# EAGLE design module (EAGLE 6.4)
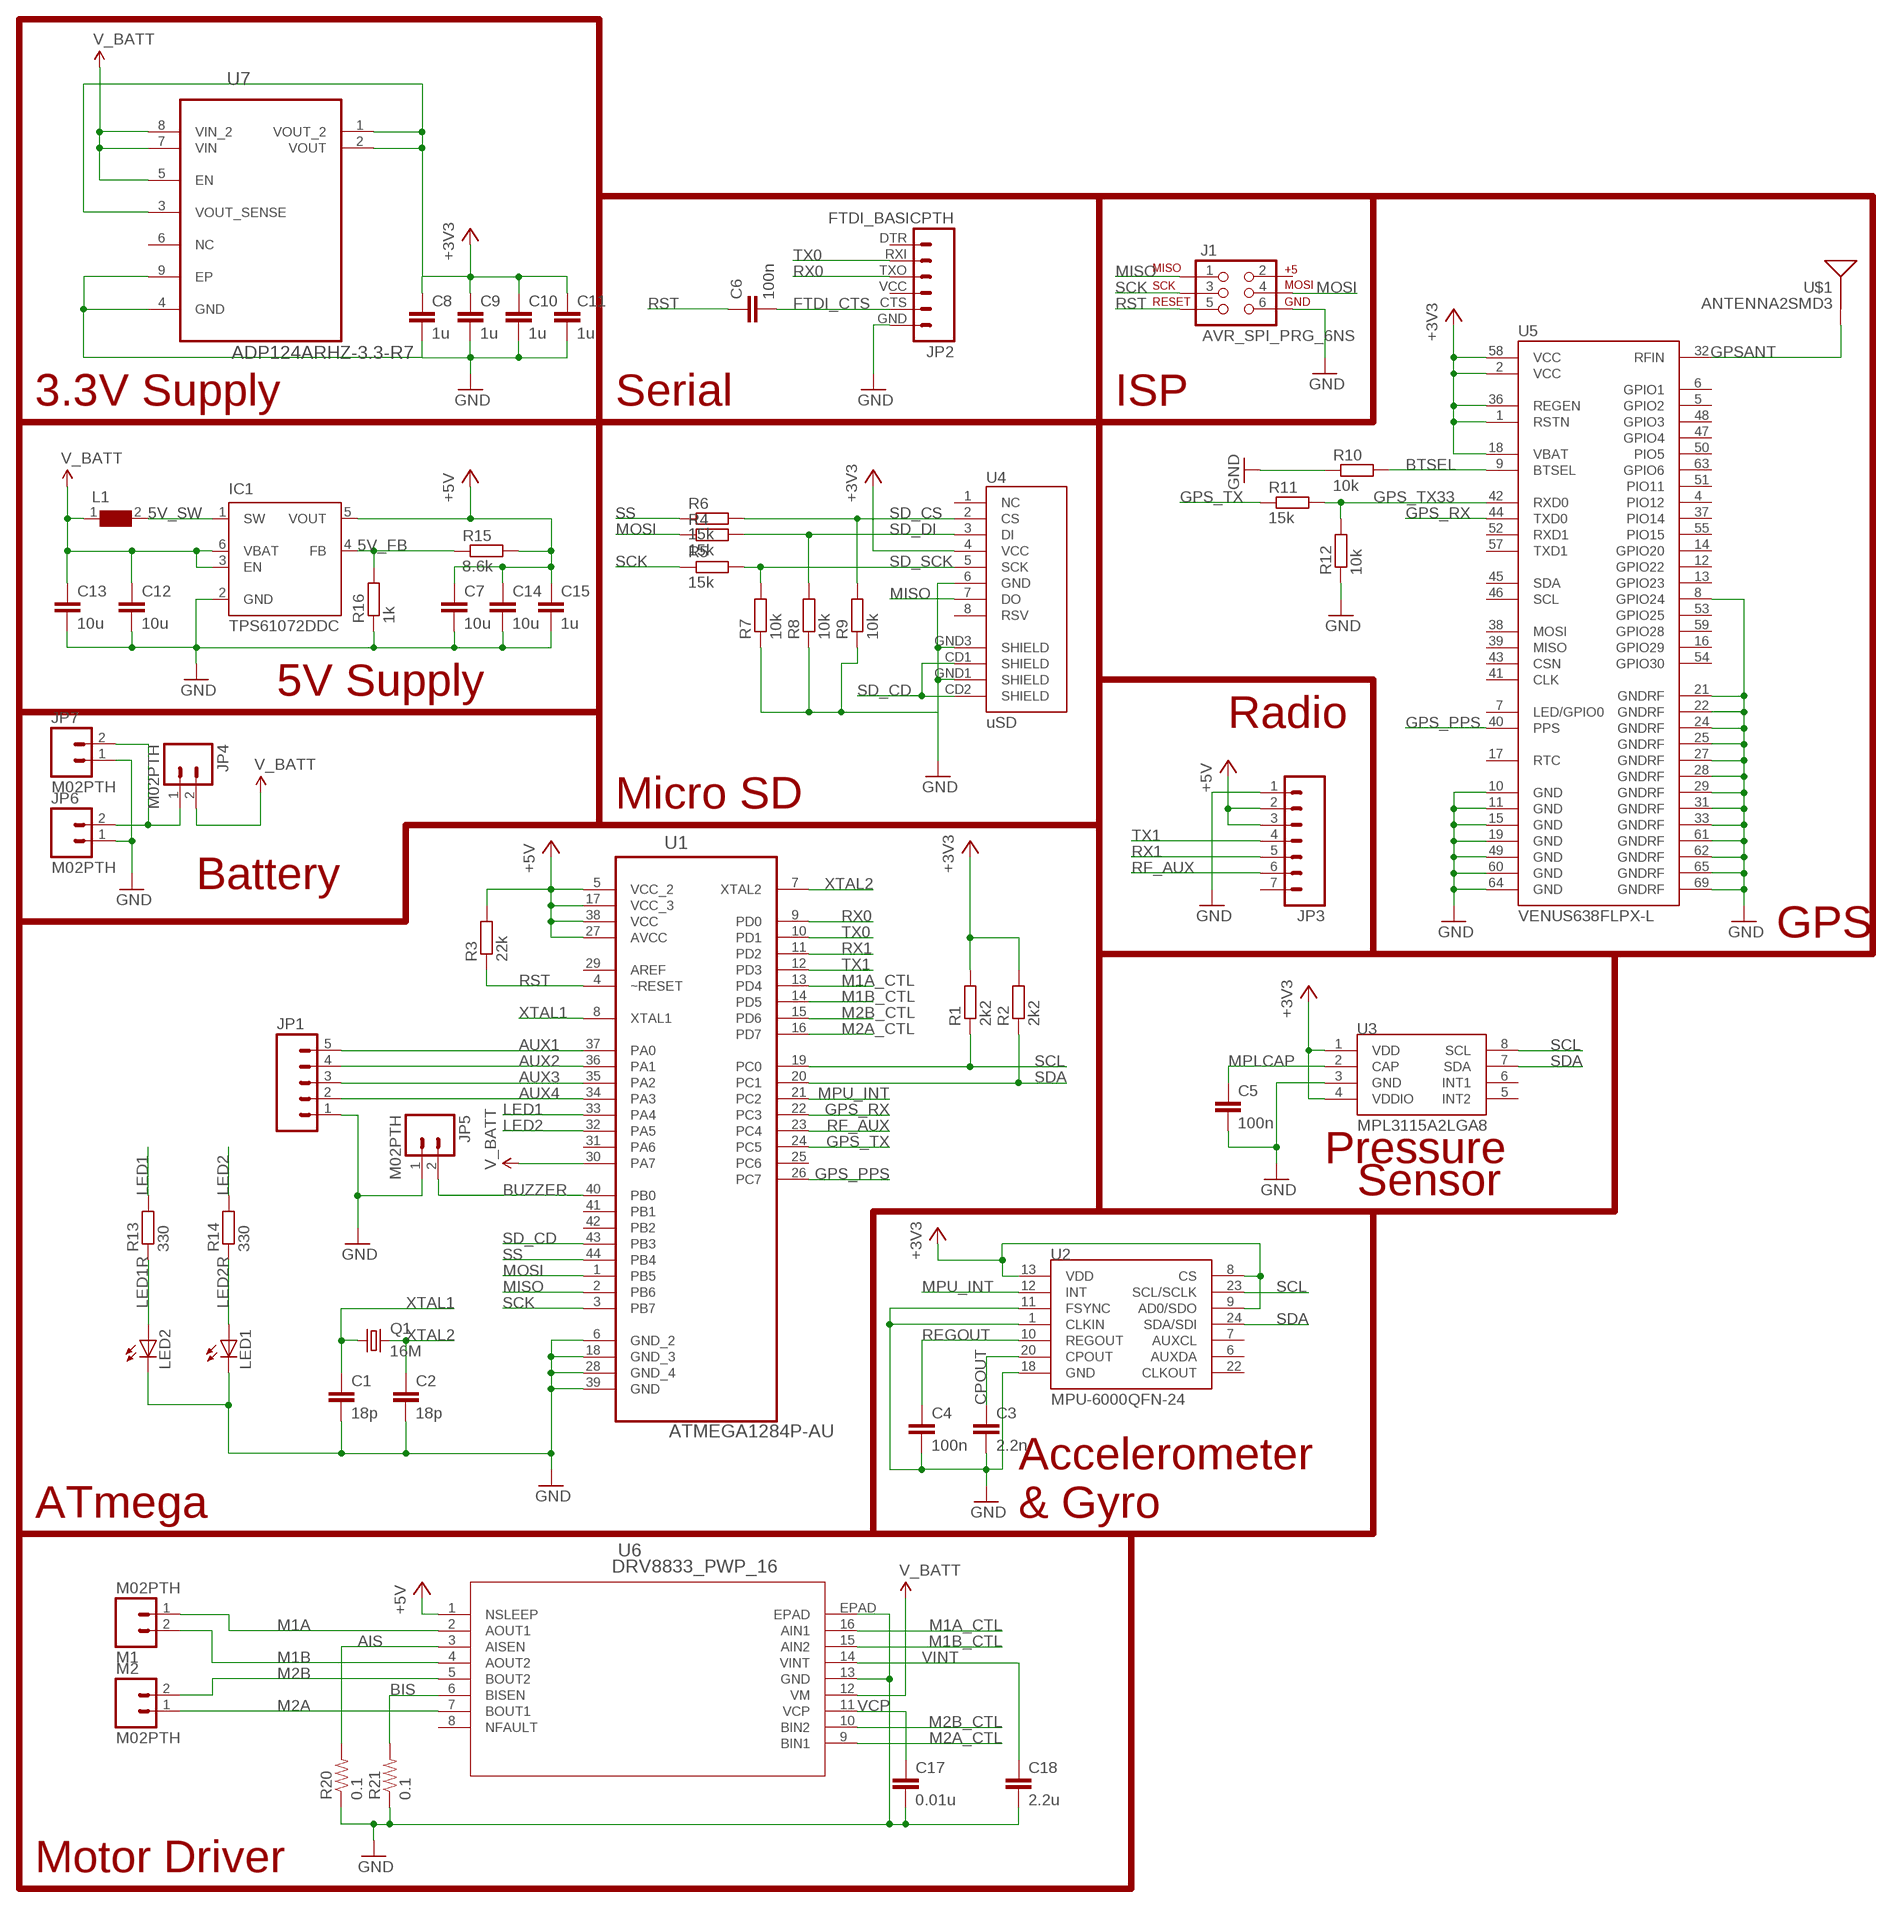
[diagram p0: schematic, sheet 1]

## Parts
C1  18p  C-EUC0805  [C0805]
C2  18p  C-EUC0805  [C0805]
C3  2.2n  C-EUC0805  [C0805]
C4  100n  C-EUC0805  [C0805]
C5  100n  C-EUC0805  [C0805]
C6  100n  C-EUC0805  [C0805]
C7  10u  C-EUC0805  [C0805]
C8  1u  C-EUC0603  [C0603]
C9  1u  C-EUC0603  [C0603]
C10  1u  C-EUC0603  [C0603]
C11  1u  C-EUC0603  [C0603]
C12  10u  C-EUC0805  [C0805]
C13  10u  C-EUC0805  [C0805]
C14  10u  C-EUC0805  [C0805]
C15  1u  C-EUC0805  [C0805]
C17  0.01u  CAP0805  [0805]
C18  2.2u  CAP0805  [0805]
IC1  TPS61072DDC  [TSOT23-6_DDC]
J1  AVR_SPI_PRG_6NS  [2X3-NS]
JP1  M05PTH  [1X05]
JP2  FTDI_BASICPTH  [FTDI_BASIC]
JP3  M07  [1X07]
JP4  M02PTH  [1X02]
JP5  M02PTH  [1X02]
JP6  M02PTH  [1X02]
JP7  M02PTH  [1X02]
L1  WE-TPC-744031004_3816  [WE-TPC_3816]
LED1  LEDCHIPLED_0805  [CHIPLED_0805]
LED2  LEDCHIPLED_0805  [CHIPLED_0805]
M1  M02PTH  [1X02]
M2  M02PTH  [1X02]
Q1  16M  CRYSTALHC49UP  [HC49UP]
R1  2k2  R-EU_R0805  [R0805]
R2  2k2  R-EU_R0805  [R0805]
R3  22k  R-EU_R0805  [R0805]
R4  15k  R-EU_R0805  [R0805]
R5  15k  R-EU_R0805  [R0805]
R6  15k  R-EU_R0805  [R0805]
R7  10k  R-EU_R0805  [R0805]
R8  10k  R-EU_R0805  [R0805]
R9  10k  R-EU_R0805  [R0805]
R10  10k  R-EU_R0805  [R0805]
R11  15k  R-EU_R0805  [R0805]
R12  10k  R-EU_R0805  [R0805]
R13  330  R-EU_R0805  [R0805]
R14  330  R-EU_R0805  [R0805]
R15  8.6k  R-EU_R0805  [R0805]
R16  1k  R-EU_R0805  [R0805]
R20  0.1  RESISTOR1206  [1206]
R21  0.1  RESISTOR1206  [1206]
U1  ATMEGA1284P-AU  [QFP80P1200X1200X120-44N]
U2  MPU-6000QFN-24  [QFN-24-TESTING]
U3  MPL3115A2LGA8  [LGA8]
U4  uSD  USD-SOCKETNEW  [MICRO-SD-SOCKET-PP]
U5  VENUS638FLPX-L  [VENUS638FLPX]
U6  DRV8833_PWP_16  [PWP16_2P31X2P46]
U7  ADP124ARHZ-3.3-R7  [SOP65P490X110-9N]
U$1  ANTENNA2SMD3  [ANTENNA-CHIP4]

## Nets
5V_FB: IC1.4(FB) R15.1 R16.2
5V_SW: IC1.1(SW) L1.2
+3V3: C8.1 C9.1 C10.1 C11.1 R1.2 R2.2 U2.8(CS) U2.9(AD0/SDO) U2.13(VDD) U3.1(VDD) U3.4(VDDIO) U4.4(VCC) U5.1(RSTN) U5.2(VCC) U5.18(VBAT) U5.36(REGEN) U5.58(VCC) U7.1(VOUT_2) U7.2(VOUT) U7.3(VOUT_SENSE)
+5V: C7.1 C14.1 C15.1 IC1.5(VOUT) JP3.2 JP3.3 R3.2 R15.2 U1.5(VCC_2) U1.17(VCC_3) U1.27(AVCC) U1.38(VCC) U6.1(NSLEEP)
AIS: R20.2 U6.3(AISEN)
AUX1: JP1.5 U1.37(PA0)
AUX2: JP1.4 U1.36(PA1)
AUX3: JP1.3 U1.35(PA2)
AUX4: JP1.2 U1.34(PA3)
BIS: R21.2 U6.6(BISEN)
BTSEL: R10.2 U5.9(BTSEL)
BUZZER: JP5.2 U1.40(PB0)
CPOUT: C3.1 U2.20(CPOUT)
FTDI_CTS: C6.2 JP2.CTS
GND: C1.2 C2.2 C3.2 C4.2 C5.2 C7.2 C8.2 C9.2 C10.2 C11.2 C12.2 C13.2 C14.2 C15.2 C17.2 C18.2 IC1.2(GND) J1.6 JP1.1 JP2.GND JP3.1 JP5.1 JP6.1 JP7.1 LED1.C LED2.C R7.1 R8.1 R9.1 R10.1 R12.1 R16.1 R20.1 R21.1 U1.6(GND_2) U1.18(GND_3) U1.28(GND_4) U1.39(GND) U2.1(CLKIN) U2.11(FSYNC) U2.18(GND) U3.3(GND) U4.6(GND) U4.GND1(SHIELD) U4.GND3(SHIELD) U5.8(GPIO24) U5.10(GND) U5.11(GND) U5.15(GND) U5.19(GND) U5.21(GNDRF) U5.22(GNDRF) U5.24(GNDRF) U5.25(GNDRF) U5.27(GNDRF) U5.28(GNDRF) U5.29(GNDRF) U5.31(GNDRF) U5.33(GNDRF) U5.49(GND) U5.60(GND) U5.61(GNDRF) U5.62(GNDRF) U5.64(GND) U5.65(GNDRF) U5.69(GNDRF) U6.13(GND) U6.EPAD U7.4(GND) U7.9(EP)
GPS_PPS: U1.26(PC7) U5.40(PPS)
GPS_RX: U1.22(PC3) U5.44(TXD0)
GPS_TX: R11.1 U1.24(PC5)
GPS_TX33: R11.2 R12.2 U5.42(RXD0)
GPSANT: U5.32(RFIN) U$1.SIG(SIGNAL)
LED1: R13.2 U1.33(PA4)
LED1R: LED2.A R13.1
LED2: R14.2 U1.32(PA5)
LED2R: LED1.A R14.1
M1A: M1.1 U6.2(AOUT1)
M1A_CTL: U1.13(PD4) U6.16(AIN1)
M1B: M1.2 U6.4(AOUT2)
M1B_CTL: U1.14(PD5) U6.15(AIN2)
M2A: M2.1 U6.7(BOUT1)
M2A_CTL: U1.16(PD7) U6.9(BIN1)
M2B: M2.2 U6.5(BOUT2)
M2B_CTL: U1.15(PD6) U6.10(BIN2)
MISO: J1.1 U1.2(PB6) U4.7(DO)
MOSI: J1.4 R4.1 U1.1(PB5)
MPLCAP: C5.1 U3.2(CAP)
MPU_INT: U1.21(PC2) U2.12(INT)
N$3: JP4.1 JP6.2 JP7.2
REGOUT: C4.1 U2.10(REGOUT)
RF_AUX: JP3.6 U1.23(PC4)
RST: C6.1 J1.5 R3.1 U1.4(~RESET)
RX0: JP2.TXO U1.9(PD0)
RX1: JP3.5 U1.11(PD2)
SCK: J1.3 R5.1 U1.3(PB7)
SCL: R1.1 U1.19(PC0) U2.23(SCL/SCLK) U3.8(SCL)
SD_CD: U1.43(PB3) U4.CD1(SHIELD) U4.CD2(SHIELD)
SD_CS: R6.2 R9.2 U4.2(CS)
SD_DI: R4.2 R8.2 U4.3(DI)
SD_SCK: R5.2 R7.2 U4.5(SCK)
SDA: R2.1 U1.20(PC1) U2.24(SDA/SDI) U3.7(SDA)
SS: R6.1 U1.44(PB4)
TX0: JP2.RXI U1.10(PD1)
TX1: JP3.4 U1.12(PD3)
V_BATT: C12.1 C13.1 IC1.3(EN) IC1.6(VBAT) JP4.2 L1.1 U1.30(PA7) U6.12(VM) U7.5(EN) U7.7(VIN) U7.8(VIN_2)
VCP: C17.1 U6.11(VCP)
VINT: C18.1 U6.14(VINT)
XTAL1: C1.1 Q1.1 U1.8(XTAL1)
XTAL2: C2.1 Q1.2 U1.7(XTAL2)
Unconnected: J1.2 JP2.DTR JP2.VCC JP3.7 U1.25(PC6) U1.29(AREF) U1.31(PA6) U1.41(PB1) U1.42(PB2) U2.6(AUXDA) U2.7(AUXCL) U2.22(CLKOUT) U3.5(INT2) U3.6(INT1) U4.1(NC) U4.8(RSV) U5.4(PIO12) U5.5(GPIO2) U5.6(GPIO1) U5.7(LED/GPIO0) U5.12(GPIO22) U5.13(GPIO23) U5.14(GPIO20) U5.16(GPIO29) U5.17(RTC) U5.37(PIO14) U5.38(MOSI) U5.39(MISO) U5.41(CLK) U5.43(CSN) U5.45(SDA) U5.46(SCL) U5.47(GPIO4) U5.48(GPIO3) U5.50(PIO5) U5.51(PIO11) U5.52(RXD1) U5.53(GPIO25) U5.54(GPIO30) U5.55(PIO15) U5.57(TXD1) U5.59(GPIO28) U5.63(GPIO6) U6.8(NFAULT) U7.6(NC)

## Notes on the sheet
- 3.3V Supply | Serial | ISP
- 5V Supply
- Radio
- Micro SD
- Battery
- GPS
- Pressure
- Sensor
- ATmega
- Accelerometer
  & Gyro
- Motor Driver

## Library data of the parts
C1-C15 = rcl:C-EU: CAPACITOR, European symbol
C17 C18 = SparkFun-Passives:CAP: Capacitor Standard 0603 ceramic capacitor, and 0.1" leaded capacitor.
IC1 = texas:TPS6107*: 90% EFFICIENT SYNCHRONOUS BOOST CONVERTER WITH 600-mA SWITCH Source: http://focus.ti.com/lit/ds/symlink/tps61070.pdf; MPN: TPS61072DDCR; OC_FARNELL: unknown; OC_NEWARK: 30M1829
J1 = SparkFun-Connectors:AVR_SPI_PRG_6: AVR ISP 6 Pin This is the reduced ISP connector for AVR programming. Common on Arduino. This footprint will take up less PCB space and can be used with a 10-pin to 6-pin adapter such as SKU: BOB-08508
JP1 = SparkFun-Connectors:M05: Header 5 Standard 5-pin 0.1" header. Use with straight break away headers (SKU : PRT-00116), right angle break away headers (PRT-00553), swiss pins (PRT-00743), machine pins (PRT-00117), and female headers (PRT-00115). Molex polarized connector foot print use with SKU : PRT-08230 with associated crimp pins and housings.
JP2 = SparkFun-Connectors:FTDI_BASIC: FTDI Basic header with labels
JP3 = SparkFun-Connectors:M07: Header 7 Standard 7-pin 0.1" header. Use with straight break away headers (SKU : PRT-00116), right angle break away headers (PRT-00553), swiss pins (PRT-00743), machine pins (PRT-00117), and female headers (PRT-00115). NOTES ON THE VARIANTS LOCK and LOCK_LONGPADS... This footprint was designed to help hold the alignment of a through-hole component (i.e. 7-pin header) while soldering it into place. You may notice that each hole has been shifted either up or down by 0.005 of an inch from it's more standard position (which is usually a perfectly straight line). This slight alteration caused the pins (the squares in the middle) to touch the edges of the holes. Because they are alternating, it causes a "brace" to hold the header in place. 0.005 has proven to be the perfect amount of "off-center" position when using our standard breakaway headers. Although looks a little odd when you look at the bare footprint, once you have a header in there, the alteration is very hard to notice. Also, if you push a header all the way into place, it is covered up entirely on the bottom side. This idea of altering the position of holes to aid alignment will be further integrated into the Sparkfun Library for other footprints. It can help hold any component with 3 or more connection pins.
JP4-JP7 M1 M2 = SparkFun-Connectors:M02: Standard 2-pin 0.1" header. Use with - straight break away headers ( PRT-00116) - right angle break away headers (PRT-00553) - swiss pins (PRT-00743) - machine pins (PRT-00117) - female headers (PRT-00115) Molex polarized connector foot print use with: PRT-08233 with associated crimp pins and housings. 2.54_SCREWTERM for use with PRT-10571. 3.5mm Screw Terminal footprints for PRT-08084 5mm Screw Terminal footprints for use with PRT-08433
L1 = WE-TPC:WE-TPC: Shielded Tiny Power Inductor WE-TPC - Extremely flat power inductor - High current capability - High reliability and perfect soldering characteristics because of integrated soldering pad - magnetically shielded -- Portable power like PDA, digital camera, PCMICA-cards and displays -- DC/DC-converter -- Recommended for switching regulator IC's from Linear Technology, National Semiconductor, Texas Instruments and Fairchild Semiconductor; MPN: 744031004; OC_FARNELL: 1635834; OC_NEWARK: 08P2473; PACKAGE: 3816; SUPPLIER: WURTH ELEKTRONIK
LED1 LED2 = led:LED: LED OSRAM: - CHIPLED LG R971, LG N971, LY N971, LG Q971, LY Q971, LO R971, LY R971 LH N974, LH R974 LS Q976, LO Q976, LY Q976 LO Q996 - Hyper CHIPLED LW Q18S LB Q993, LB Q99A, LB R99A - SideLED LS A670, LO A670, LY A670, LG A670, LP A670 LB A673, LV A673, LT A673, LW A673 LH A674 LY A675 LS A676, LA A676, LO A676, LY A676, LW A676 LS A679, LY A679, LG A679 - Hyper Micro SIDELED® LS Y876, LA Y876, LO Y876, LY Y876 LT Y87S - SmartLED LW L88C, LW L88S LB L89C, LB L89S, LG L890 LS L89K, LO L89K, LY L89K LS L896, LA L896, LO L896, LY L896 - TOPLED LS T670, LO T670, LY T670, LG T670, LP T670 LSG T670, LSP T670, LSY T670, LOP T670, LYG T670 LG T671, LOG T671, LSG T671 LB T673, LV T673, LT T673, LW T673 LH T674 LS T676, LA T676, LO T676, LY T676, LB T676, LH T676, LSB T676, LW T676 LB T67C, LV T67C, LT T67C, LS T67K, LO T67K, LY T67K, LW E67C LS E67B, LA E67B, LO E67B, LY E67B, LB E67C, LV E67C, LT E67C LW T67C LS T679, LY T679, LG T679 LS T770, LO T770, LY T770, LG T770, LP T770 LB T773, LV T773, LT T773, LW T773 LH T774 LS E675, LA E675, LY E675, LS T675 LS T776, LA T776, LO T776, LY T776, LB T776 LHGB T686 LT T68C, LB T68C - Hyper Mini TOPLED® LB M676 - Mini TOPLED Santana® LG M470 LS M47K, LO M47K, LY M47K Source: http://www.osram.convergy.de LUXEON: - LUMILED® LXK2-PW12-R00, LXK2-PW12-S00, LXK2-PW14-U00, LXK2-PW14-V00 LXK2-PM12-R00, LXK2-PM12-S00, LXK2-PM14-U00 LXK2-PE12-Q00, LXK2-PE12-R00, LXK2-PE12-S00, LXK2-PE14-T00, LXK2-PE14-U00 LXK2-PB12-K00, LXK2-PB12-L00, LXK2-PB12-M00, LXK2-PB14-N00, LXK2-PB14-P00, LXK2-PB14-Q00 LXK2-PR12-L00, LXK2-PR12-M00, LXK2-PR14-Q00, LXK2-PR14-R00 LXK2-PD12-Q00, LXK2-PD12-R00, LXK2-PD12-S00 LXK2-PH12-R00, LXK2-PH12-S00 LXK2-PL12-P00, LXK2-PL12-Q00, LXK2-PL12-R00 Source: www.luxeon.com KINGBRIGHT: KA-3528ASYC Source: www.kingbright.com
Q1 = crystal:CRYSTAL: CRYSTAL; OC_FARNELL: unknown; OC_NEWARK: unknown
R1-R16 = rcl:R-EU_: RESISTOR, European symbol
R20 R21 = SparkFun-Passives:RESISTOR: Resistor Basic schematic elements and footprints for 0603, 1206, and PTH resistors.
U1 = pic18f25k50:ATMEGA1284P-AU: Microcontroller with Programmable Flash; MPN: ATMEGA1284P-AU; OC_FARNELL: 1715480; OC_NEWARK: 15R0263; PACKAGE: TQFP-44; SUPPLIER: Atmel
U2 = SparkFun-Sensors:MPU-6000: MPU-6000 - I2C address is 0x68 with AD0 low and 0x69 with AD0 high.
U3 = SparkFun-Sensors:MPL3115A2: Altimeter/Pressure Sensor, I2C, 1.95V-3.6V supply, 50 to 110kPa
U4 = SparkFun-Connectors:USD-SOCKET: microSD Socket Push-push type uSD socket. Schematic element and footprint production proven. Spark Fun Electronics SKU : PRT-00127. tDoc lines correctly indicate media card edge positions when inserting (unlocked, locked, depressed).
U5 = SparkFun-RF:VENUS638FLPX-L: Venus638FLPX-L GPS Receiver Venus638FLPx is a high performance, low cost, single chip GPS receiver targeting mobile consumer and cellular handset applications. It offers very low power consumption, high sensitivity, and best in class signal acquisition and time-to-first-fix performance. Venus638FLPx contains all the necessary components of a complete GPS receiver, includes 1.2dB cascaded system NF RF front-end, GPS baseband signal processor, 0.5ppm TCXO, 32.768kHz RTC crystal, RTC LDO regulator, and passive components. It requires very low external component count and takes up only 100mm2 PCB footprint. Dedicated massive-correlator signal parameter search engine within the baseband enables rapid search of all the available satellites and acquisition of very weak signal. An advanced track engine allows weak signal tracking and positioning in harsh environments such as urban canyons and under deep foliage. The self-contained architecture keeps GPS processing off the host and allows integration into applications with very little resource. FEATURES 20Hz update rate -148dBm cold start sensitivity -165dBm tracking sensitivity 29 second cold start TTFF 3.5 second TTFF with AGPS 1 second hot start 2.5m accuracy Multipath detection and suppression Jamming detection and mitigation SBAS (WAAS / EGNOS) support 7-day extended ephemeris AGPS 67mW full power navigation Works directly with active or passive antenna Internal flash for optional 75K point data logging Supports external SPI flash memory data logging Complete receiver in 10mm x 10mm x 1.3mm size Contains LNA, SAW Filter, TCXO, RTC Xtal, LDO Pb-free RoHS compliant
U6 = L5973D:DRV8833_PWP_16; DATASHEETURL: http://www.ti.com/lit/gpn/DRV8833; DESCRIPTION: 2A Low Voltage Dual Brushed DC or Single Bipolar Stepper Motor Driver (PWM Ctrl); FAMILY_NAME: BRUSHED DC DRIVER; GENERIC_PART_NUMBER: DRV8833; INDUSTRY_STD_PKG_TYPE: HTSSOP; MANUFACTURER: Texas Instruments; MANUFACTURER_PART_NUMBER: drv8833_pwp_16; PACKAGE_DESIGNATOR: PWP; PIN_COUNT: 16; VENDOR: Texas Instruments
U7 = pic18f25k50:ADP124ARHZ-3.3-R7: 5.5 V Input, 500 mA, Low Quiescent Current, CMOS Linear Regulators; MPN: ADP124ARHZ-3.3-R7; OC_FARNELL: 1827296; OC_NEWARK: 63R9752; PACKAGE: SOIC-8; SUPPLIER: Analog Devices
U$1 = SparkFun-RF:ANTENNA2: Chip antenna Single endded antenna. Common with smaller chip antennas. CHIP4 package is the GPS Chip Antenna SKU: GPS-08418. CHIP5 package is 2.4GHz chip antenna SKU: WRL-00144.

## Board
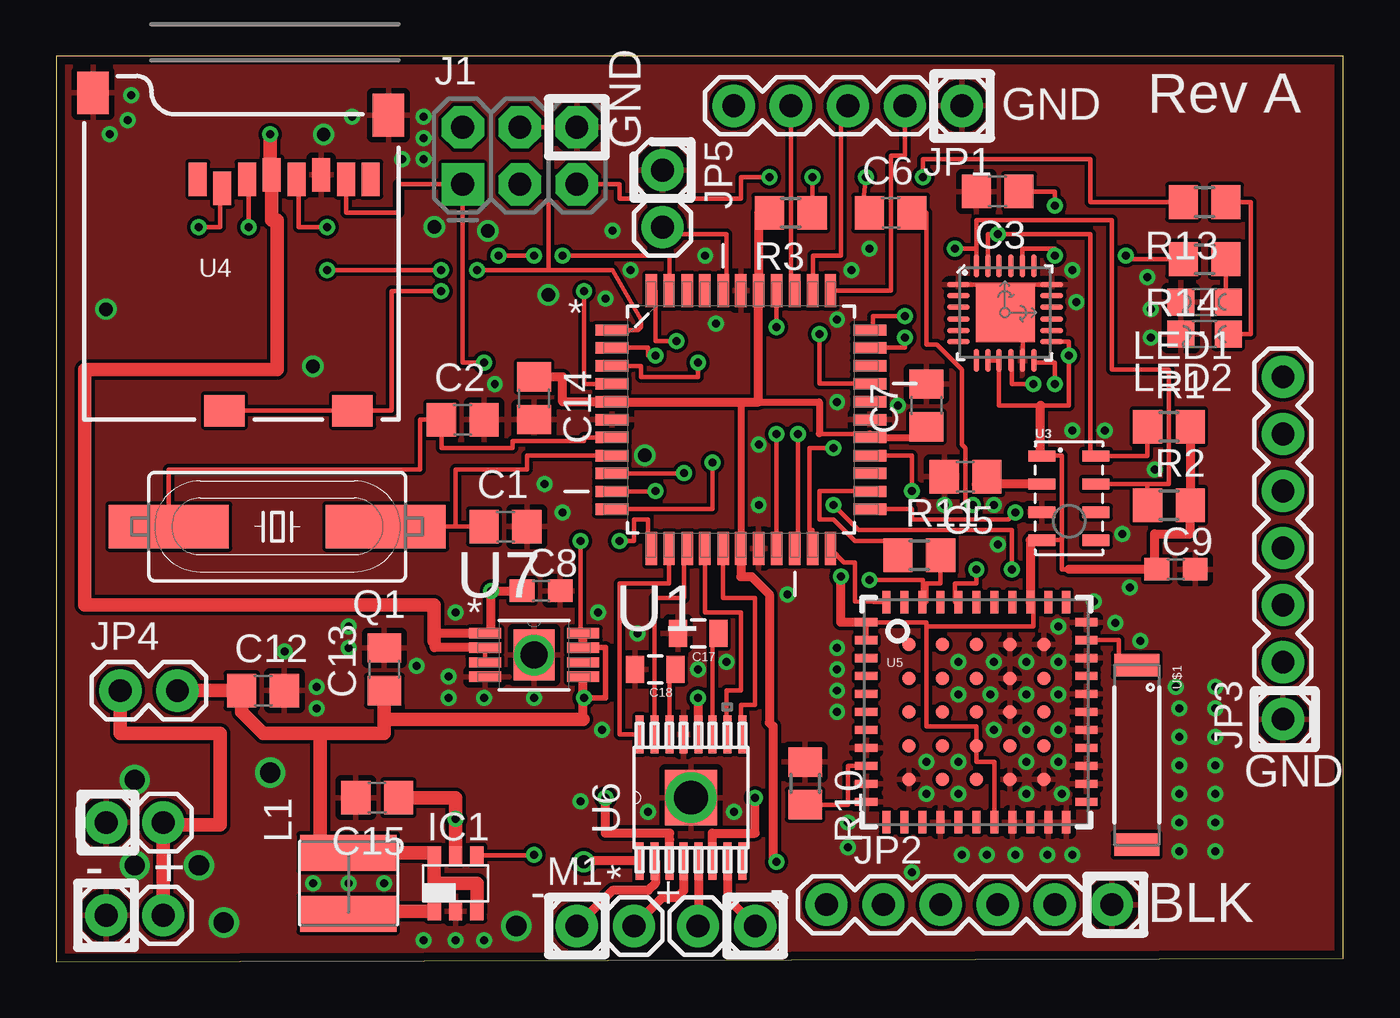
[diagram p1: board, top side]
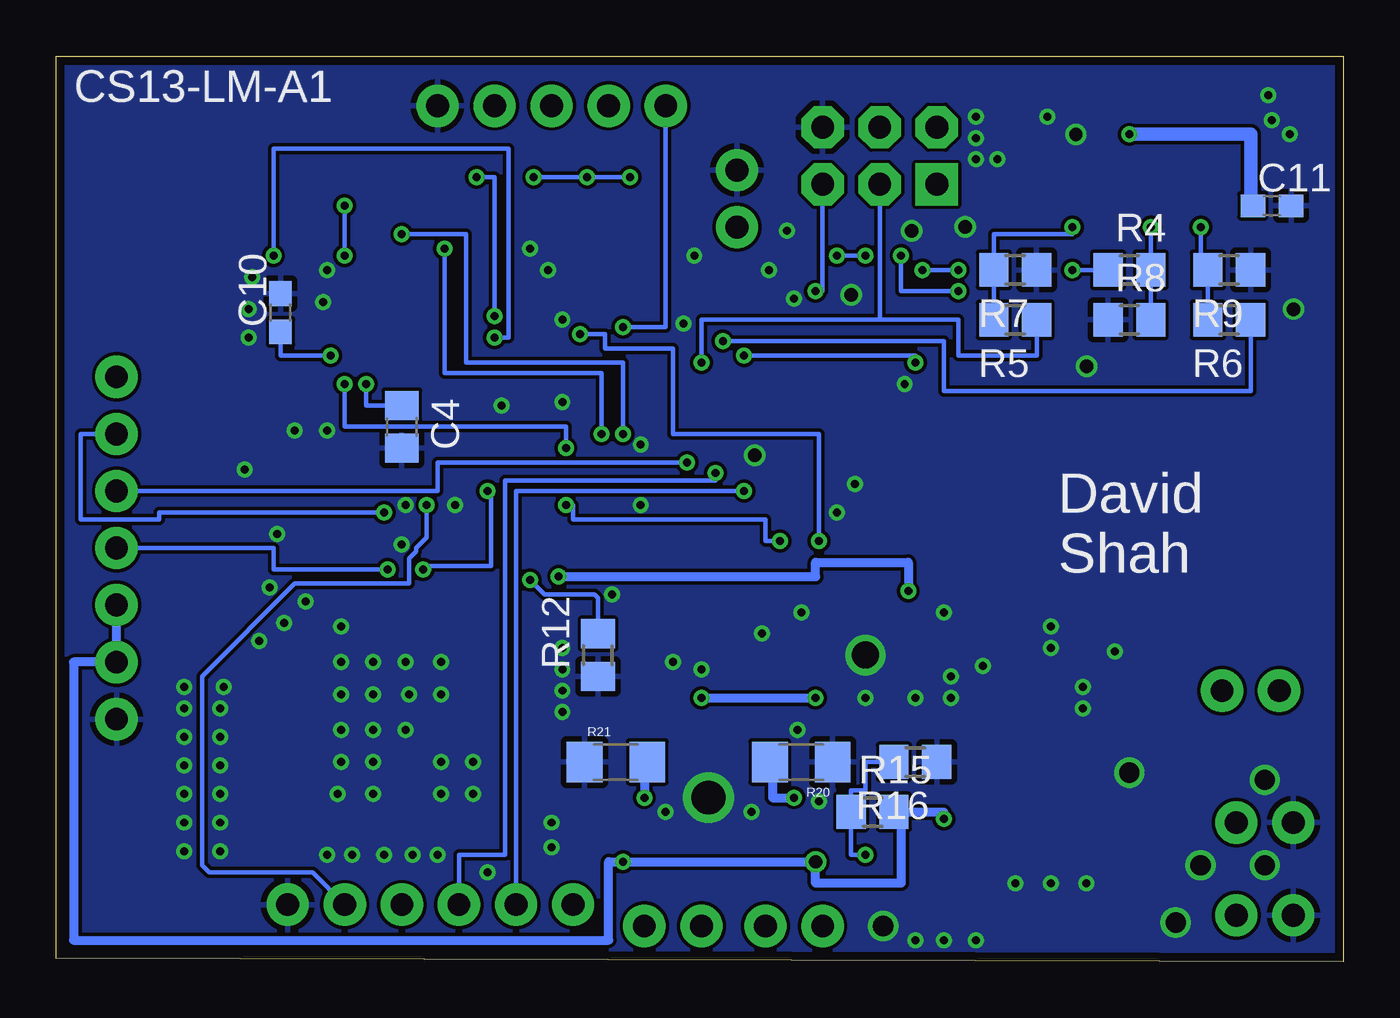
[diagram p2: board, bottom side, seen from below]

Size 57.3 x 40.31 mm. Coordinates in mm from the lower left corner, seen from the top.
Outline: 0,0 57.3,0.16 57.3,40.31 0,40.31 0,0
Copper layers (1*16): Top 0.0356mm / dielectric 1.5011mm / Bottom 0.0356mm
Design rules "LaenPCBOrder *": minimum track width 6mil, minimum drill 13mil, track to track 6mil, track to pad 6mil, pad to pad 6mil, via to via 6mil, smd to smd 6mil, copper to edge 15mil, drill to drill 6mil, minimum pad ring 7mil, minimum via ring 7mil, stop-mask expansion 4mil, vias tented up to drill 28mil, thermal gap 10mil

### Footprints (pad centres in the part's own frame; a part is rotated, then mirrored left to right if it is on the bottom)
C0805 = smd 1.3 x 1.5: 1 -0.95,0; 2 0.95,0
C0603 = smd 1.1 x 1: 1 -0.85,0; 2 0.85,0
0805 = smd 0.8 x 1.2: 1 -0.9,0; 2 0.9,0
TSOT23-6_DDC = smd 0.6 x 0.8: 1 -0.95,-1.25; 2 0,-1.25; 3 0.95,-1.25; 4 0.95,1.25; 5 0,1.25; 6 -0.95,1.25
2X3-NS = drill 1.016 pad 1.88 square: 1 -2.54,-1.27 | drill 1.016 pad 1.88 octagon: 2 -2.54,1.27; 3 0,-1.27; 4 0,1.27; 5 2.54,-1.27; 6 2.54,1.27
1X05 = drill 1.016 pad 1.88: 1 0,0; 2 2.54,0; 3 5.08,0; 4 7.62,0; 5 10.16,0
FTDI_BASIC = drill 1.016 pad 1.88: CTS 10.16,0; DTR 0,0; GND 12.7,0; RXI 2.54,0; TXO 5.08,0; VCC 7.62,0
1X07 = drill 1.016 pad 1.88: 1 0,0; 2 2.54,0; 3 5.08,0; 4 7.62,0; 5 10.16,0; 6 12.7,0; 7 15.24,0
1X02 = drill 1.016 pad 1.88: 1 0,0; 2 2.54,0
WE-TPC_3816 = smd 1.6 x 4.3: 1 -1.356,-0.014; 2 1.356,-0.014
CHIPLED_0805 = smd 1.2 x 1.2: A 0,-1.05; C 0,1.05
HC49UP = smd 5.334 x 1.93: 1 -4.826,0; 2 4.826,0
R0805 = smd 1.3 x 1.5: 1 -0.95,0; 2 0.95,0
1206 = smd 1.6 x 1.8: 1 -1.4,0; 2 1.4,0
QFP80P1200X1200X120-44N = smd 1.473 x 0.508: 1 -5.74,3.988; 2 -5.74,3.2; 3 -5.74,2.388; 4 -5.74,1.6; 5 -5.74,0.787; 6 -5.74,0; 7 -5.74,-0.787; 8 -5.74,-1.6; 9 -5.74,-2.388; 10 -5.74,-3.2; 11 -5.74,-3.988; 23 5.74,-3.988; 24 5.74,-3.2; 25 5.74,-2.388; 26 5.74,-1.6; 27 5.74,-0.787; 28 5.74,0; 29 5.74,0.787; 30 5.74,1.6; 31 5.74,2.388; 32 5.74,3.2; 33 5.74,3.988 | smd 0.508 x 1.473: 12 -3.988,-5.74; 13 -3.2,-5.74; 14 -2.388,-5.74; 15 -1.6,-5.74; 16 -0.787,-5.74; 17 0,-5.74; 18 0.787,-5.74; 19 1.6,-5.74; 20 2.388,-5.74; 21 3.2,-5.74; 22 3.988,-5.74; 34 3.988,5.74; 35 3.2,5.74; 36 2.388,5.74; 37 1.6,5.74; 38 0.787,5.74; 39 0,5.74; 40 -0.787,5.74; 41 -1.6,5.74; 42 -2.388,5.74; 43 -3.2,5.74; 44 -3.988,5.74
QFN-24-TESTING = smd 1.016 x 0.254: 1 -2.066,1.257; 2 -2.066,0.75; 3 -2.066,0.247; 4 -2.066,-0.287; 5 -2.066,-0.792; 6 -2.066,-1.297; 13 2.086,-1.297; 14 2.086,-0.792; 15 2.086,-0.287; 16 2.086,0.247; 17 2.086,0.75; 18 2.086,1.257 | smd 0.254 x 1.016: 7 -1.267,-2.122; 8 -0.762,-2.122; 9 -0.258,-2.122; 10 0.278,-2.122; 11 0.78,-2.122; 12 1.287,-2.122; 19 1.287,2.082; 20 0.78,2.082; 21 0.278,2.082; 22 -0.258,2.082; 23 -0.762,2.082; 24 -1.267,2.082 | smd 2.616 x 2.616: P$1 0.02,-0.01
LGA8 = smd 1.2 x 0.5: 1 -1.2,1.875; 2 -1.2,0.625; 3 -1.2,-0.625; 4 -1.2,-1.875; 5 1.2,-1.875; 6 1.2,-0.625; 7 1.2,0.625; 8 1.2,1.875
MICRO-SD-SOCKET-PP = smd 0.8 x 1.5: 1 -8.94,10.7; 2 -7.84,10.3; 3 -6.74,10.7; 4 -5.64,10.9; 5 -4.54,10.7; 6 -3.44,10.9; 7 -2.34,10.7; 8 -1.24,10.7 | smd 1.8 x 1.4: CD1 -2.05,0.4; CD2 -7.75,0.4 | smd 1.4 x 1.9: GND1 -13.6,14.55; GND3 -0.45,13.55
VENUS638FLPX = smd 1 x 0.36: 1 -4.9,4; 2 -4.9,3.2; 3 -4.9,2.4; 4 -4.9,1.6; 5 -4.9,0.8; 6 -4.9,0; 7 -4.9,-0.8; 8 -4.9,-1.6; 9 -4.9,-2.4; 10 -4.9,-3.2; 11 -4.9,-4; 23 4.9,-4; 24 4.9,-3.2; 25 4.9,-2.4; 26 4.9,-1.6; 27 4.9,-0.8; 28 4.9,0; 29 4.9,0.8; 30 4.9,1.6; 31 4.9,2.4; 32 4.9,3.2; 33 4.9,4 | smd 0.36 x 1: 12 -4,-4.9; 13 -3.2,-4.9; 14 -2.4,-4.9; 15 -1.6,-4.9; 16 -0.8,-4.9; 17 0,-4.9; 18 0.8,-4.9; 19 1.6,-4.9; 20 2.4,-4.9; 21 3.2,-4.9; 22 4,-4.9; 34 4,4.9; 35 3.2,4.9; 36 2.4,4.9; 37 1.6,4.9; 38 0.8,4.9; 39 0,4.9; 40 -0.8,4.9; 41 -1.6,4.9; 42 -2.4,4.9; 43 -3.2,4.9; 44 -4,4.9 | smd 0.6 x 0.6: 45 -3,3; 46 -3,1.5; 47 -3,0; 48 -3,-1.5; 49 -3,-3; 50 -1.5,3; 51 -1.5,1.5; 52 -1.5,0; 53 -1.5,-1.5; 54 -1.5,-3; 55 0,3; 56 0,1.5; 57 0,0; 58 0,-1.5; 59 0,-3; 60 1.5,3; 61 1.5,1.5; 62 1.5,0; 63 1.5,-1.5; 64 1.5,-3; 65 3,3; 66 3,1.5; 67 3,0; 68 3,-1.5; 69 3,-3
PWP16_2P31X2P46 = smd 1.676 x 0.356: 1 -2.819,2.286; 2 -2.819,1.626; 3 -2.819,0.965; 4 -2.819,0.33; 5 -2.819,-0.33; 6 -2.819,-0.965; 7 -2.819,-1.626; 8 -2.819,-2.286; 9 2.819,-2.286; 10 2.819,-1.626; 11 2.819,-0.965; 12 2.819,-0.33; 13 2.819,0.33; 14 2.819,0.965; 15 2.819,1.626; 16 2.819,2.286 | smd 2.464 x 2.311: EPAD 0,0
SOP65P490X110-9N = smd 1.422 x 0.457: 1 -2.184,0.965; 2 -2.184,0.33; 3 -2.184,-0.33; 4 -2.184,-0.965; 5 2.184,-0.965; 6 2.184,-0.33; 7 2.184,0.33; 8 2.184,0.965 | smd 1.829 x 2.261: 9 0,0
ANTENNA-CHIP4 = smd 1 x 2: NC 4,0; SIG -4,0

### Placement (x,y rotation side)
C1  20,19.37 0 top
C2  18.1,24.13 0 top
C3  41.91,34.29 180 top
C4  41.91,23.81 270 bottom
C5  40.48,21.59 180 top
C6  37.15,33.34 0 top
C7  38.73,24.77 90 top
C8  21.59,16.51 0 top
C9  49.85,17.46 0 top
C10  47.31,28.89 90 bottom
C11  3.17,33.66 0 bottom
C12  9.21,12.06 0 top
C13  14.61,13.02 90 top
C14  21.27,25.08 270 top
C15  14.29,7.3 180 top
C17  28.57,14.61 180 top
C18  26.67,13.02 180 top
IC1  17.78,3.49 0 top
J1  20.64,35.88 0 top
JP1  40.32,38.1 180 top
JP2  34.29,2.54 0 top
JP3  54.61,10.79 90 top
JP4  2.86,12.06 0 top
JP5  26.99,35.24 270 top
JP6  2.22,6.19 0 top
JP7  2.22,2.06 0 top
L1  13.02,3.49 270 top
LED1  51.12,29.37 90 top
LED2  51.12,27.94 90 top
M1  23.18,1.59 0 top
M2  31.11,1.59 180 top
Q1  9.84,19.37 180 top
R1  49.53,23.81 0 top
R2  49.53,20.32 0 top
R3  32.7,33.34 180 top
R4  9.53,30.8 0 bottom
R5  14.61,28.57 180 bottom
R6  5.08,28.57 180 bottom
R7  14.61,30.8 180 bottom
R8  9.53,28.57 0 bottom
R9  5.08,30.8 180 bottom
R10  33.34,7.94 270 top
R11  38.42,18.1 0 top
R12  33.18,13.65 90 bottom
R13  51.12,33.81 180 top
R14  51.12,31.27 180 top
R15  20.95,6.67 0 bottom
R16  19.05,8.89 180 bottom
R20  24.13,8.89 180 bottom
R21  32.38,8.89 0 bottom
U1  30.48,24.13 0 top
U2  42.23,28.89 0 top
U3  45.09,20.64 0 top
U4  15.24,24.13 0 top
U5  40.96,11.11 0 top
U6  28.26,7.3 90 top
U7  21.27,13.65 0 top
U$1  48.1,9.21 270 top

### Tracks (layer width: path | path; a pad name or v marks a point on that pad's centre or on a via)
5V_FB  (via drill 0.36)
  Top 0.203: IC1.4 21.27,4.74 v21.27,4.76
  Bottom 0.203: R15.1 21.91,4.76 v21.27,4.76 | R15.1 | R15.1 21.91,7.62 21.27,7.62 21.27,8.89 R16.2
5V_SW
  Top 0.61: IC1.1 13,2.24 L1.2
+3V3  (via drill 0.36)
  Top 0.203: U5.2 U5.1 38.73,15.11 38.73,14.92 | 38.73,14.92 38.73,10.48 40.96,10.48 U5.58 40.96,8.89 41.76,8.89 U5.18 | U5.36 43.5,16.01 43.5,14.92 38.73,14.92 | 43.5,18.76 U3.4 44.77,18.76 | U2.8 U2.9 41.97,24.77 43.81,24.77 45.09,24.77 v45.09,26.99 45.09,27.6 U2.13 | 44.77,18.76 44.77,22.54 43.88,22.54 | U7.3 U7.2 | 45.09,17.46 44.77,17.46 44.77,18.76
  Top 0.305: U4.4 9.84,35.03 9.84,34.92
  Top 0.406: U7.2 16.83,13.98 16.83,14.29 | 16.83,14.61 16.83,14.62 U7.1 19.37,14.62 v19.37,16.51 C8.1 | U5.1 34.92,15.11 v34.92,17.14 | 43.5,18.76 43.36,18.76 U5.36 | U3.1 43.88,22.54 43.81,22.54 43.81,24.77 | 45.09,17.46 C9.1 48.9,17.46 48.9,19.05 50.48,19.05 R2.2 R1.2
  Top 0.61: v9.53,36.83 9.53,35.03 U4.4 9.6,33.02 9.84,33.02 9.84,26.35 1.27,26.35 1.27,15.88 16.83,15.88 16.83,14.61 16.83,14.29
  Bottom 0.203: C10.1 47.31,26.99 v45.09,26.99
  Bottom 0.406: v34.92,17.14 23.5,17.14 23.5,17.78 19.37,17.78 v19.37,16.51
  Bottom 0.61: C11.1 4.13,33.66 4.13,36.83 v9.53,36.83
+5V  (via drill 0.36, 0.6)
  Top 0.203: 36.22,23.5 33.97,23.5
  Top 0.305: C7.1 38.73,23.34 U1.27 36.22,23.5 | 33.97,23.5 33.97,24.92 31.27,24.92 30.48,24.92 U1.17
  Top 0.406: C14.1 22.23,26.04 22.54,26.04 22.54,24.92 U1.5 31.27,24.92 U1.38 31.27,33.34 R3.2 | U6.1 23.5,4.48 v23.5,4.45 | U1.17 30.48,17.14 30.96,17.14 31.75,16.35 31.75,10.64 31.91,10.48 31.91,4.6 v32.07,4.45
  Top 0.61: IC1.5 v17.78,6.35 17.78,7.3 C15.1
  Bottom 0.406: v17.78,6.35 17.78,6.67 R15.2 19.68,6.67 19.68,3.49 23.5,3.49 v23.5,4.45 v32.07,4.45 32.7,4.45 32.7,0.95 56.52,0.95 56.52,13.34 JP3.2 JP3.3
AIS  (via drill 0.36)
  Top 0.406: U6.3 27.3,5.44 27.3,5.71 24.45,5.71 v24.45,7.3
  Bottom 0.406: R20.2 25.4,8.89 25.4,7.3 v24.45,7.3
AUX1  (via drill 0.36)
  Top 0.203: U1.37 32.07,29.87 v32.07,28.26
  Bottom 0.203: JP1.5 30.16,28.26 v32.07,28.26
AUX2
  Top 0.203: U1.36 32.7,29.87 JP1.4
AUX3
  Top 0.203: JP1.3 34.92,38.1 34.92,31.43 33.68,31.43 U1.35
AUX4
  Top 0.203: U1.34 37.15,29.87 37.15,35.88 37.78,35.88 JP1.2
BIS  (via drill 0.36)
  Top 0.406: U6.6 29.21,5.71 31.11,5.71 v31.11,7.3
  Bottom 0.406: R21.2 31.11,8.89 v31.11,7.3
BTSEL
  Top 0.203: U5.9 35.24,8.71 35.24,6.99 R10.2
BUZZER
  Top 0.203: U1.40 29.84,29.87 29.84,32.38 26.99,32.38 JP5.2
CPOUT  (via drill 0.36)
  Top 0.203: C3.1 44.45,34.29 v44.45,33.66 | v44.45,31.43 44.45,31.75 43.01,31.75 U2.20
  Bottom 0.203: v44.45,33.66 v44.45,31.43
FTDI_CTS  (via drill 0.36)
  Top 0.203: C6.2 38.73,33.34 38.73,27.46 39.21,27.46 40.32,26.35 40.32,23.02 40.48,22.86 40.48,20.48 40.8,20.48 v40.8,20.32
  Bottom 0.203: v40.8,20.32 40.8,18.89 41.27,18.41 41.27,18.26 41.59,17.94 41.59,16.83 46.67,16.83 50.8,12.7 50.8,4.29 50.48,3.97 45.88,3.97 JP2.CTS
GND  (via drill 0.36, 0.6, 0.9, 1.2, 1.5)
  Top 0.203: U5.62 42.23,11.11 | U2.11 43.02,26.77 43.02,30.15 | U2.18 43.02,30.15 | U2.1 43.02,30.15
  other vias: 28.57,13.02 25.88,14.61 31.27,23.02 31.27,20.32 50.01,4.92 50.01,6.19 50.01,7.46 50.01,8.73 50.01,10 50.01,11.27 49.85,12.22 47.15,15.08 45.24,4.76 44.13,4.76 42.7,4.76 40.32,4.76 41.43,4.76 38.73,8.89 38.73,7.46 43.18,7.46 43.18,8.89 43.18,10.32 43.18,11.91 43.18,13.34 41.75,13.34 41.59,11.91 44.61,13.34 40.16,13.34 44.61,14.92 37.47,24.77 45.24,23.65 46.67,23.65 48.9,21.91 41.75,20.32 41.91,18.57 39.53,20.32 45.24,30.8 45.4,29.37 48.58,30.48 48.74,29.05 48.74,27.78 34.77,28.57 29.37,28.42 25.56,30.8 28.89,31.43 35.4,30.8 36.2,31.75 24.45,29.53 24.77,32.54 47.47,19.05 3.49,4.29 7.46,1.75 20.48,1.59 9.53,8.41 28.26,7.3 2.22,29.05 11.43,26.51 11.91,36.83 16.83,32.7 19.21,32.54 21.91,29.69 26.19,22.54 34.77,24.92 29.84,13.34 32.54,16.35 38.1,3.97 47.78,16.67 19.53,25.72 21.75,21.27 22.54,20 2.38,36.83 3.17,37.47 3.33,38.58 13.18,37.62 16.35,37.62 16.35,36.67 16.35,35.72 15.4,35.72 40.16,11.91 44.61,11.91 44.61,10.32 41.75,10.32 40.16,8.89 40.16,7.46 44.77,7.46 44.61,8.89 35.24,6.19 35.24,5.08 34.77,13.97 34.77,13.02 34.77,12.06 34.77,11.11 46.2,16.03 51.59,12.22 51.59,11.27 51.59,10 51.59,8.73 51.59,7.46 51.59,6.19 51.59,4.92 48.26,14.29 11.43,3.49 13.02,3.49 14.61,3.49 17.78,0.95 16.35,0.95 19.05,0.95 26.35,6.67 30.16,6.67 23.34,7.14 24.29,10.32 21.27,13.65 17.78,15.56 17.46,12.7 17.46,11.75 19.05,11.75 21.27,11.75 24.13,15.56 10.16,13.81 11.59,12.22 11.59,11.27 13.02,14.92 13.02,13.97 16.03,13.18 6.35,4.29 3.49,8.1
  pour Top: 57.94,40.96 -0.64,40.8 -0.95,-1.27 57.94,-1.11
  pour Bottom: -2.22,41.43 -2.38,40.32 -2.06,-2.22 59.69,-2.22 59.85,41.75
GPS_PPS  (via drill 0.36)
  Top 0.203: U5.40 40.01,16.01 40.01,16.83 40.96,16.83 v40.96,17.46 | U1.26 38.1,22.53 v38.1,20.95
  Bottom 0.203: v38.1,20.95 37.94,20.95 37.94,17.62 40.96,17.62 v40.96,17.46
GPS_RX
  Top 0.203: U5.44 36.38,16.01 35.56,16.03 35.56,17.78 35.08,17.78 U1.22
GPS_TX
  Top 0.203: R11.1 37.15,18.1 37.15,18.73 35.56,18.73 34.61,19.68 33.97,19.68 33.97,20.95 36.22,20.95 U1.24
GPS_TX33  (via drill 0.36)
  Top 0.203: R11.2 39.37,16.83 38.73,16.83 38.73,16.01 U5.42 38.58,16.01 38.58,16.99 v36.2,16.99 36.04,16.99
  Bottom 0.203: R12.2 33.18,16.19 33.34,16.35 35.56,16.35 v36.2,16.99
GPSANT
  Top 0.203: U5.32 47.31,14.31 47.31,13.34 48.26,13.34 U$1.SIG
LED1  (via drill 0.36)
  Top 0.203: R13.2 46.04,33.81 46.04,35.72 38.58,35.72 v38.58,34.92 | U1.33 36.35,28.12 36.35,28.73 v37.78,28.73
  Bottom 0.203: v38.58,34.92 37.78,34.92 v37.78,28.73
LED1R
  Top 0.203: R13.1 53.18,33.81 53.18,27.94 LED2.A
LED2  (via drill 0.36)
  Top 0.203: U1.32 37.78,27.33 v37.78,27.78 | R14.2 47.62,31.27 v47.62,31.43
  Bottom 0.203: v37.78,27.78 37.15,27.78 37.15,36.2 47.62,36.2 v47.62,31.43
LED2R
  Top 0.203: LED1.A 52.07,29.37 R14.1
M1A
  Top 0.406: U6.2 26.67,4.48 26.67,3.49 26.35,3.17 24.77,3.17 M1.1
M1A_CTL
  Top 0.203: U6.16 25.08,10.12 25.08,16.83 27.28,16.83 U1.13
M1B
  Top 0.406: M1.2 26.99,2.86 27.62,2.86 27.94,3.17 U6.4
M1B_CTL
  Top 0.203: U1.14 27.94,18.39 27.94,16.19 26.63,16.19 U6.15
M2A
  Top 0.406: U6.7 29.88,2.9 29.84,2.86 M2.1
M2A_CTL
  Top 0.203: U6.9 30.48,10.12 30.48,11.43 31.11,11.43 31.11,16.19 29.69,16.19 U1.16
M2B
  Top 0.406: U6.5 28.59,1.6 M2.2
M2B_CTL
  Top 0.203: U1.15 28.89,18.39 28.89,15.56 30.48,15.56 30.48,12.06 29.84,12.06 29.84,10.79 29.88,10.79 U6.10
MISO  (via drill 0.36)
  Top 0.203: U4.7 12.9,33.34 15.24,33.34 15.24,34.61 J1.1 18.1,26.67 v19.05,26.67 | 24.74,27.3 U1.2 26.35,27.33 26.35,26.99 v26.67,26.99
  Bottom 0.203: v26.67,26.99 19.05,26.99 v19.05,26.67
MOSI  (via drill 0.36)
  Top 0.203: U1.1 25.89,28.12 26.04,28.26 26.04,28.57 24.77,30.8 21.91,30.8 | 21.91,30.8 21.91,37.15 J1.4 | 21.91,30.8 v18.73,30.8 | v12.06,30.8 v17.14,30.8
  Bottom 0.203: R4.1 v12.06,30.8 | v17.14,30.8 v18.73,30.8
MPLCAP
  Top 0.406: U3.2 40.95,21.26 C5.1
MPU_INT  (via drill 0.36)
  Top 0.203: U2.12 43.5,26.77 43.5,26.67 44.45,26.67 v44.45,25.72 | v34.61,22.86 33.52,22.86 33.52,19.21 33.66,19.21 33.66,18.39 U1.21
  Bottom 0.203: v44.45,25.72 44.45,23.81 34.61,23.81 v34.61,22.86
N$3
  Top 0.61: JP4.1 2.86,10.16 7.3,10.16 7.3,6.08 4.76,6.08 JP6.2 JP7.2
REGOUT  (via drill 0.36)
  Top 0.203: U2.10 42.55,26.77 42.55,25.72 v43.5,25.72
  Bottom 0.203: C4.1 43.5,24.76 v43.5,25.72
RF_AUX  (via drill 0.36)
  Top 0.203: U1.23 38.1,20.14 38.1,19.68 42.39,19.68 v42.7,20
  Bottom 0.203: v42.7,20 52.7,20 52.7,19.68 56.2,19.68 56.2,23.5 JP3.6
RST  (via drill 0.36)
  Top 0.203: J1.5 25.08,34.61 25.08,33.97 30.48,33.97 30.48,34.92 v31.75,34.92 | R3.1 v33.66,34.92 | C6.1 35.88,33.34 v36.04,34.92 | U1.4 24.45,25.73 24.45,25.72 23.5,25.72 v23.5,29.84
  Bottom 0.203: v31.75,34.92 v33.66,34.92 v36.04,34.92 | v23.5,29.84 23.18,29.84 J1.5
RX0  (via drill 0.36)
  Top 0.203: U1.9 v27.94,21.74 v27.94,21.75
  Bottom 0.203: JP2.TXO 39.37,4.76 37.31,4.76 37.31,21.43 27.94,21.43 v27.94,21.75
RX1  (via drill 0.36)
  Top 0.203: U1.11 29.21,20.14 v29.21,22.23
  Bottom 0.203: v29.21,22.23 40.32,22.23 40.32,20.95 JP3.5
SCK  (via drill 0.36)
  Top 0.203: 28.57,26.2 v28.57,26.67 28.57,26.04 26.04,26.04 26.04,26.52 U1.3
  Bottom 0.203: R5.1 13.65,26.99 17.14,26.99 17.14,28.57 20.64,28.57 | 20.64,28.57 J1.3 | 20.64,28.57 28.57,28.57 v28.57,26.67
SCL  (via drill 0.36)
  Top 0.203: R1.1 48.58,22.51 U3.8 46.04,22.51 46.04,32.38 v41.91,32.38 41.47,32.38 U2.23 | U1.19 32.07,18.39 v32.07,23.5
  Bottom 0.203: v32.07,23.5 32.07,26.67 39.05,26.67 39.05,32.38 v41.91,32.38
SD_CD  (via drill 0.36)
  Top 0.203: U4.CD2 U4.CD1 14.92,24.53 14.92,29.84 v17.14,29.84 | U1.43 27.3,29.87 27.3,31.43 v22.54,31.43 | v19.68,31.43 v21.27,31.43
  Bottom 0.203: v17.14,29.84 19.68,29.84 v19.68,31.43 | v22.54,31.43 v21.27,31.43
SD_CS  (via drill 0.36)
  Top 0.203: U4.2 7.3,34.43 7.3,32.7 v6.35,32.7
  Bottom 0.203: v6.35,32.7 6.35,30.8 R9.2 R6.2
SD_DI  (via drill 0.36)
  Top 0.203: U4.3 8.57,34.83 v8.57,32.7
  Bottom 0.203: R8.2 R4.2 v8.57,32.7
SD_SCK  (via drill 0.36)
  Top 0.203: U4.5 10.79,34.83 10.79,32.7 v12.06,32.7
  Bottom 0.203: R5.2 R7.2 15.56,32.38 12.06,32.38 v12.06,32.7
SDA  (via drill 0.36)
  Top 0.203: R2.1 48.58,21.26 U3.7 49.53,21.26 49.53,26.35 46.99,26.35 46.99,33.02 40.96,33.02 40.96,31.75 | 40.96,31.75 U2.24 | U1.20 33.02,18.39 v33.02,23.5 | 40.96,31.75 v40.01,31.75
  Bottom 0.203: v33.02,23.5 33.02,26.19 40.01,26.19 v40.01,31.75
SS  (via drill 0.36)
  Top 0.203: U1.44 26.67,29.87 26.67,27.62 v27.62,27.62
  Bottom 0.203: v27.62,27.62 17.78,27.62 17.78,25.4 4.12,25.4 R6.1
TX0  (via drill 0.36)
  Top 0.203: U1.10 26.67,20.93 v26.67,20.95
  Bottom 0.203: JP2.RXI 36.83,20.95 v26.67,20.95
TX1  (via drill 0.36)
  Top 0.203: U1.12 26.35,18.39 26.35,19.68 25.72,19.68 25.72,18.73 v25.08,18.73 | v34.61,20.32 35.72,19.21 42.55,19.21 v42.55,17.46
  Bottom 0.203: JP3.4 47.62,18.41 47.62,17.46 v42.55,17.46 | v25.08,18.73 25.72,18.73 25.72,19.68 34.29,19.68 34.29,20.32 v34.61,20.32
V_BATT  (via drill 0.36)
  Top 0.203: U1.30 33.97,25.73 v33.97,27.94 | U7.8 23.34,14.62 v23.34,18.73
  Top 0.254: U7.7 24.45,13.98 24.45,11.75 v23.5,11.75 23.5,12.69 U7.5
  Top 0.406: 23.46,10.79 U7.5 | U6.12 28.59,11.73 v28.57,11.75 | U7.7 U7.8
  Top 0.61: JP4.2 C12.1 | C12.1 8.57,12.06 8.57,12.38 | IC1.3 18.73,3.49 16.83,3.49 IC1.6 16.83,4.85 L1.1 13,5.08 11.75,5.08 11.75,10.16 | C13.1 14.61,10.79 | 14.61,10.79 23.46,10.79 | C12.1 8.26,11.11 9.21,10.16 11.75,10.16 | 11.75,10.16 14.61,10.16 14.61,10.79
  Bottom 0.203: v33.97,27.94 32.86,27.94 32.86,27.3 29.84,27.3 29.84,23.5 23.34,23.5 v23.34,18.73
  Bottom 0.406: v28.57,11.75 v23.5,11.75 23.46,11.75
VCP
  Top 0.203: 29.53,14.61 C17.1 29.21,14.61 29.21,13.65 29.22,12.06 U6.11
VINT
  Top 0.203: C18.1 27.29,13.02 U6.14
XTAL1
  Top 0.203: Q1.1 17.78,19.37 | C1.1 17.78,19.37 | 17.78,19.37 17.78,21.91 20.95,21.91 20.95,22.54 24.74,22.54 U1.8
XTAL2
  Top 0.203: Q1.2 5.02,21.91 16.19,21.91 16.19,24.13 C2.1 17.15,22.86 20.32,22.86 20.32,23.18 23.5,23.18 23.5,23.34 U1.7

### Text on the board
tNames: Rev A | GND | GND | GND | - | + | - | - | + | BLK
bNames: CS13-LM-A1 | David / Shah